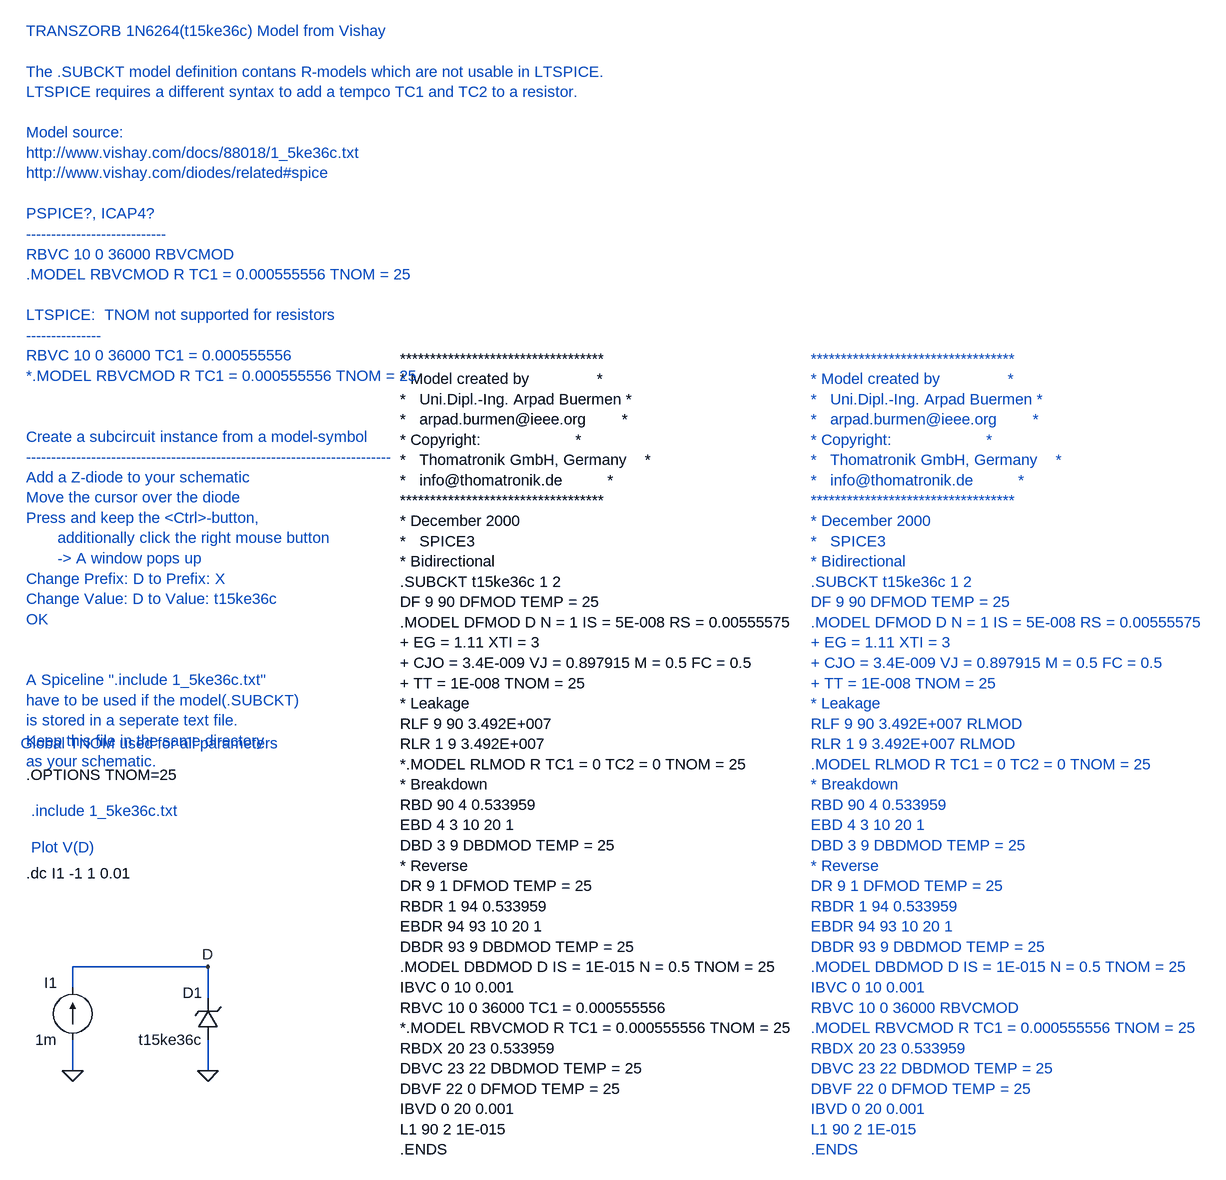
[diagram p0: schematic TRANSZORB_1N6264.asc]
TRANSZORB_1N6264.asc, the LTspice schematic file:
Version 4
SHEET 1 1748 1188
WIRE 96 336 96 384
WIRE 96 272 96 224
WIRE 96 224 -112 224
WIRE -112 224 -112 256
WIRE -112 336 -112 384
FLAG 96 384 0
FLAG -112 384 0
FLAG 96 224 D
SYMBOL zener 112 336 R180
WINDOW 0 24 72 Left 0
WINDOW 3 24 0 Left 0
SYMATTR InstName D1
SYMATTR Value t15ke36c
SYMATTR Prefix X
SYMBOL current -112 336 R180
WINDOW 0 24 88 Left 0
WINDOW 3 24 0 Left 0
SYMATTR InstName I1
SYMATTR Value 1m
TEXT 392 -712 Left 0 !**********************************\n* Model created by               *\n*   Uni.Dipl.-Ing. Arpad Buermen *\n*   arpad.burmen@ieee.org        *\n* Copyright:                     *\n*   Thomatronik GmbH, Germany    *\n*   info@thomatronik.de          *\n**********************************\n* December 2000\n*   SPICE3\n* Bidirectional\n.SUBCKT t15ke36c 1 2\nDF 9 90 DFMOD TEMP = 25\n.MODEL DFMOD D N = 1 IS = 5E-008 RS = 0.00555575\n+ EG = 1.11 XTI = 3\n+ CJO = 3.4E-009 VJ = 0.897915 M = 0.5 FC = 0.5\n+ TT = 1E-008 TNOM = 25\n* Leakage\nRLF 9 90 3.492E+007  \nRLR 1 9 3.492E+007  \n*.MODEL RLMOD R TC1 = 0 TC2 = 0 TNOM = 25 \n* Breakdown\nRBD 90 4 0.533959\nEBD 4 3 10 20 1\nDBD 3 9 DBDMOD TEMP = 25\n* Reverse\nDR 9 1 DFMOD TEMP = 25\nRBDR 1 94 0.533959\nEBDR 94 93 10 20 1\nDBDR 93 9 DBDMOD TEMP = 25\n.MODEL DBDMOD D IS = 1E-015 N = 0.5 TNOM = 25\nIBVC 0 10 0.001\nRBVC 10 0 36000 TC1 = 0.000555556   \n*.MODEL RBVCMOD R TC1 = 0.000555556 TNOM = 25\nRBDX 20 23 0.533959\nDBVC 23 22 DBDMOD TEMP = 25\nDBVF 22 0 DFMOD TEMP = 25\nIBVD 0 20 0.001\nL1 90 2 1E-015\n.ENDS
TEXT -184 80 Left 0 !.dc I1 -1 1 0.01
TEXT 1024 -712 Left 0 ;**********************************\n* Model created by               *\n*   Uni.Dipl.-Ing. Arpad Buermen *\n*   arpad.burmen@ieee.org        *\n* Copyright:                     *\n*   Thomatronik GmbH, Germany    *\n*   info@thomatronik.de          *\n**********************************\n* December 2000\n*   SPICE3\n* Bidirectional\n.SUBCKT t15ke36c 1 2\nDF 9 90 DFMOD TEMP = 25\n.MODEL DFMOD D N = 1 IS = 5E-008 RS = 0.00555575\n+ EG = 1.11 XTI = 3\n+ CJO = 3.4E-009 VJ = 0.897915 M = 0.5 FC = 0.5\n+ TT = 1E-008 TNOM = 25\n* Leakage\nRLF 9 90 3.492E+007 RLMOD\nRLR 1 9 3.492E+007 RLMOD\n.MODEL RLMOD R TC1 = 0 TC2 = 0 TNOM = 25\n* Breakdown\nRBD 90 4 0.533959\nEBD 4 3 10 20 1\nDBD 3 9 DBDMOD TEMP = 25\n* Reverse\nDR 9 1 DFMOD TEMP = 25\nRBDR 1 94 0.533959\nEBDR 94 93 10 20 1\nDBDR 93 9 DBDMOD TEMP = 25\n.MODEL DBDMOD D IS = 1E-015 N = 0.5 TNOM = 25\nIBVC 0 10 0.001\nRBVC 10 0 36000 RBVCMOD\n.MODEL RBVCMOD R TC1 = 0.000555556 TNOM = 25\nRBDX 20 23 0.533959\nDBVC 23 22 DBDMOD TEMP = 25\nDBVF 22 0 DFMOD TEMP = 25\nIBVD 0 20 0.001\nL1 90 2 1E-015\n.ENDS
TEXT -184 -1216 Left 0 ;TRANSZORB 1N6264(t15ke36c) Model from Vishay\n \nThe .SUBCKT model definition contans R-models which are not usable in LTSPICE.\nLTSPICE requires a different syntax to add a tempco TC1 and TC2 to a resistor.\n \nModel source:\nhttp://www.vishay.com/docs/88018/1_5ke36c.txt\nhttp://www.vishay.com/diodes/related#spice\n \nPSPICE?, ICAP4?\n----------------------------\nRBVC 10 0 36000 RBVCMOD\n.MODEL RBVCMOD R TC1 = 0.000555556 TNOM = 25\n \nLTSPICE:  TNOM not supported for resistors\n---------------\nRBVC 10 0 36000 TC1 = 0.000555556 \n*.MODEL RBVCMOD R TC1 = 0.000555556 TNOM = 25\n \n \nCreate a subcircuit instance from a model-symbol\n-------------------------------------------------------------------------\nAdd a Z-diode to your schematic\nMove the cursor over the diode\nPress and keep the <Ctrl>-button, \n       additionally click the right mouse button \n       -> A window pops up\nChange Prefix: D to Prefix: X\nChange Value: D to Value: t15ke36c\nOK\n \n \nA Spiceline ".include 1_5ke36c.txt" \nhave to be used if the model(.SUBCKT)\nis stored in a seperate text file.\nKeep this file in the same directory \nas your schematic.
TEXT -176 40 Left 0 ;Plot V(D)
TEXT -184 -72 Left 0 !.OPTIONS TNOM=25
TEXT -192 -120 Left 0 ;Global TNOM used for all parameters
TEXT -176 -16 Left 0 ;.include 1_5ke36c.txt

The netlist it stands for:
* TRANSZORB_1N6264.asc
XD1 0 D t15ke36c  ; pins + -
I1 0 D 1m
**********************************
* Model created by               *
*   Uni.Dipl.-Ing. Arpad Buermen *
*   arpad.burmen@ieee.org        *
* Copyright:                     *
*   Thomatronik GmbH, Germany    *
*   info@thomatronik.de          *
**********************************
* December 2000
*   SPICE3
* Bidirectional
.SUBCKT t15ke36c 1 2
DF 9 90 DFMOD TEMP = 25
.MODEL DFMOD D N = 1 IS = 5E-008 RS = 0.00555575
+ EG = 1.11 XTI = 3
+ CJO = 3.4E-009 VJ = 0.897915 M = 0.5 FC = 0.5
+ TT = 1E-008 TNOM = 25
* Leakage
RLF 9 90 3.492E+007
RLR 1 9 3.492E+007
*.MODEL RLMOD R TC1 = 0 TC2 = 0 TNOM = 25
* Breakdown
RBD 90 4 0.533959
EBD 4 3 10 20 1
DBD 3 9 DBDMOD TEMP = 25
* Reverse
DR 9 1 DFMOD TEMP = 25
RBDR 1 94 0.533959
EBDR 94 93 10 20 1
DBDR 93 9 DBDMOD TEMP = 25
.MODEL DBDMOD D IS = 1E-015 N = 0.5 TNOM = 25
IBVC 0 10 0.001
RBVC 10 0 36000 TC1 = 0.000555556
*.MODEL RBVCMOD R TC1 = 0.000555556 TNOM = 25
RBDX 20 23 0.533959
DBVC 23 22 DBDMOD TEMP = 25
DBVF 22 0 DFMOD TEMP = 25
IBVD 0 20 0.001
L1 90 2 1E-015
.ENDS
.dc I1 -1 1 0.01
* **********************************
* * Model created by               *
* *   Uni.Dipl.-Ing. Arpad Buermen *
* *   arpad.burmen@ieee.org        *
* * Copyright:                     *
* *   Thomatronik GmbH, Germany    *
* *   info@thomatronik.de          *
* **********************************
* * December 2000
* *   SPICE3
* * Bidirectional
* .SUBCKT t15ke36c 1 2
* DF 9 90 DFMOD TEMP = 25
* .MODEL DFMOD D N = 1 IS = 5E-008 RS = 0.00555575
* + EG = 1.11 XTI = 3
* + CJO = 3.4E-009 VJ = 0.897915 M = 0.5 FC = 0.5
* + TT = 1E-008 TNOM = 25
* * Leakage
* RLF 9 90 3.492E+007 RLMOD
* RLR 1 9 3.492E+007 RLMOD
* .MODEL RLMOD R TC1 = 0 TC2 = 0 TNOM = 25
* * Breakdown
* RBD 90 4 0.533959
* EBD 4 3 10 20 1
* DBD 3 9 DBDMOD TEMP = 25
* * Reverse
* DR 9 1 DFMOD TEMP = 25
* RBDR 1 94 0.533959
* EBDR 94 93 10 20 1
* DBDR 93 9 DBDMOD TEMP = 25
* .MODEL DBDMOD D IS = 1E-015 N = 0.5 TNOM = 25
* IBVC 0 10 0.001
* RBVC 10 0 36000 RBVCMOD
* .MODEL RBVCMOD R TC1 = 0.000555556 TNOM = 25
* RBDX 20 23 0.533959
* DBVC 23 22 DBDMOD TEMP = 25
* DBVF 22 0 DFMOD TEMP = 25
* IBVD 0 20 0.001
* L1 90 2 1E-015
* .ENDS
* TRANSZORB 1N6264(t15ke36c) Model from Vishay
* The .SUBCKT model definition contans R-models which are not usable in LTSPICE.
* LTSPICE requires a different syntax to add a tempco TC1 and TC2 to a resistor.
* Model source:
* http://www.vishay.com/docs/88018/1_5ke36c.txt
* http://www.vishay.com/diodes/related#spice
* PSPICE?, ICAP4?
* ----------------------------
* RBVC 10 0 36000 RBVCMOD
* .MODEL RBVCMOD R TC1 = 0.000555556 TNOM = 25
* LTSPICE:  TNOM not supported for resistors
* ---------------
* RBVC 10 0 36000 TC1 = 0.000555556
* *.MODEL RBVCMOD R TC1 = 0.000555556 TNOM = 25
* Create a subcircuit instance from a model-symbol
* -------------------------------------------------------------------------
* Add a Z-diode to your schematic
* Move the cursor over the diode
* Press and keep the <Ctrl>-button,
*        additionally click the right mouse button
*        -> A window pops up
* Change Prefix: D to Prefix: X
* Change Value: D to Value: t15ke36c
* OK
* A Spiceline ".include 1_5ke36c.txt"
* have to be used if the model(.SUBCKT)
* is stored in a seperate text file.
* Keep this file in the same directory
* as your schematic.
* Plot V(D)
.OPTIONS TNOM=25
* Global TNOM used for all parameters
* .include 1_5ke36c.txt
.backanno
.end